# EAGLE board csa_cpu_v2.0k (EAGLE 4.15), part 1 of 2
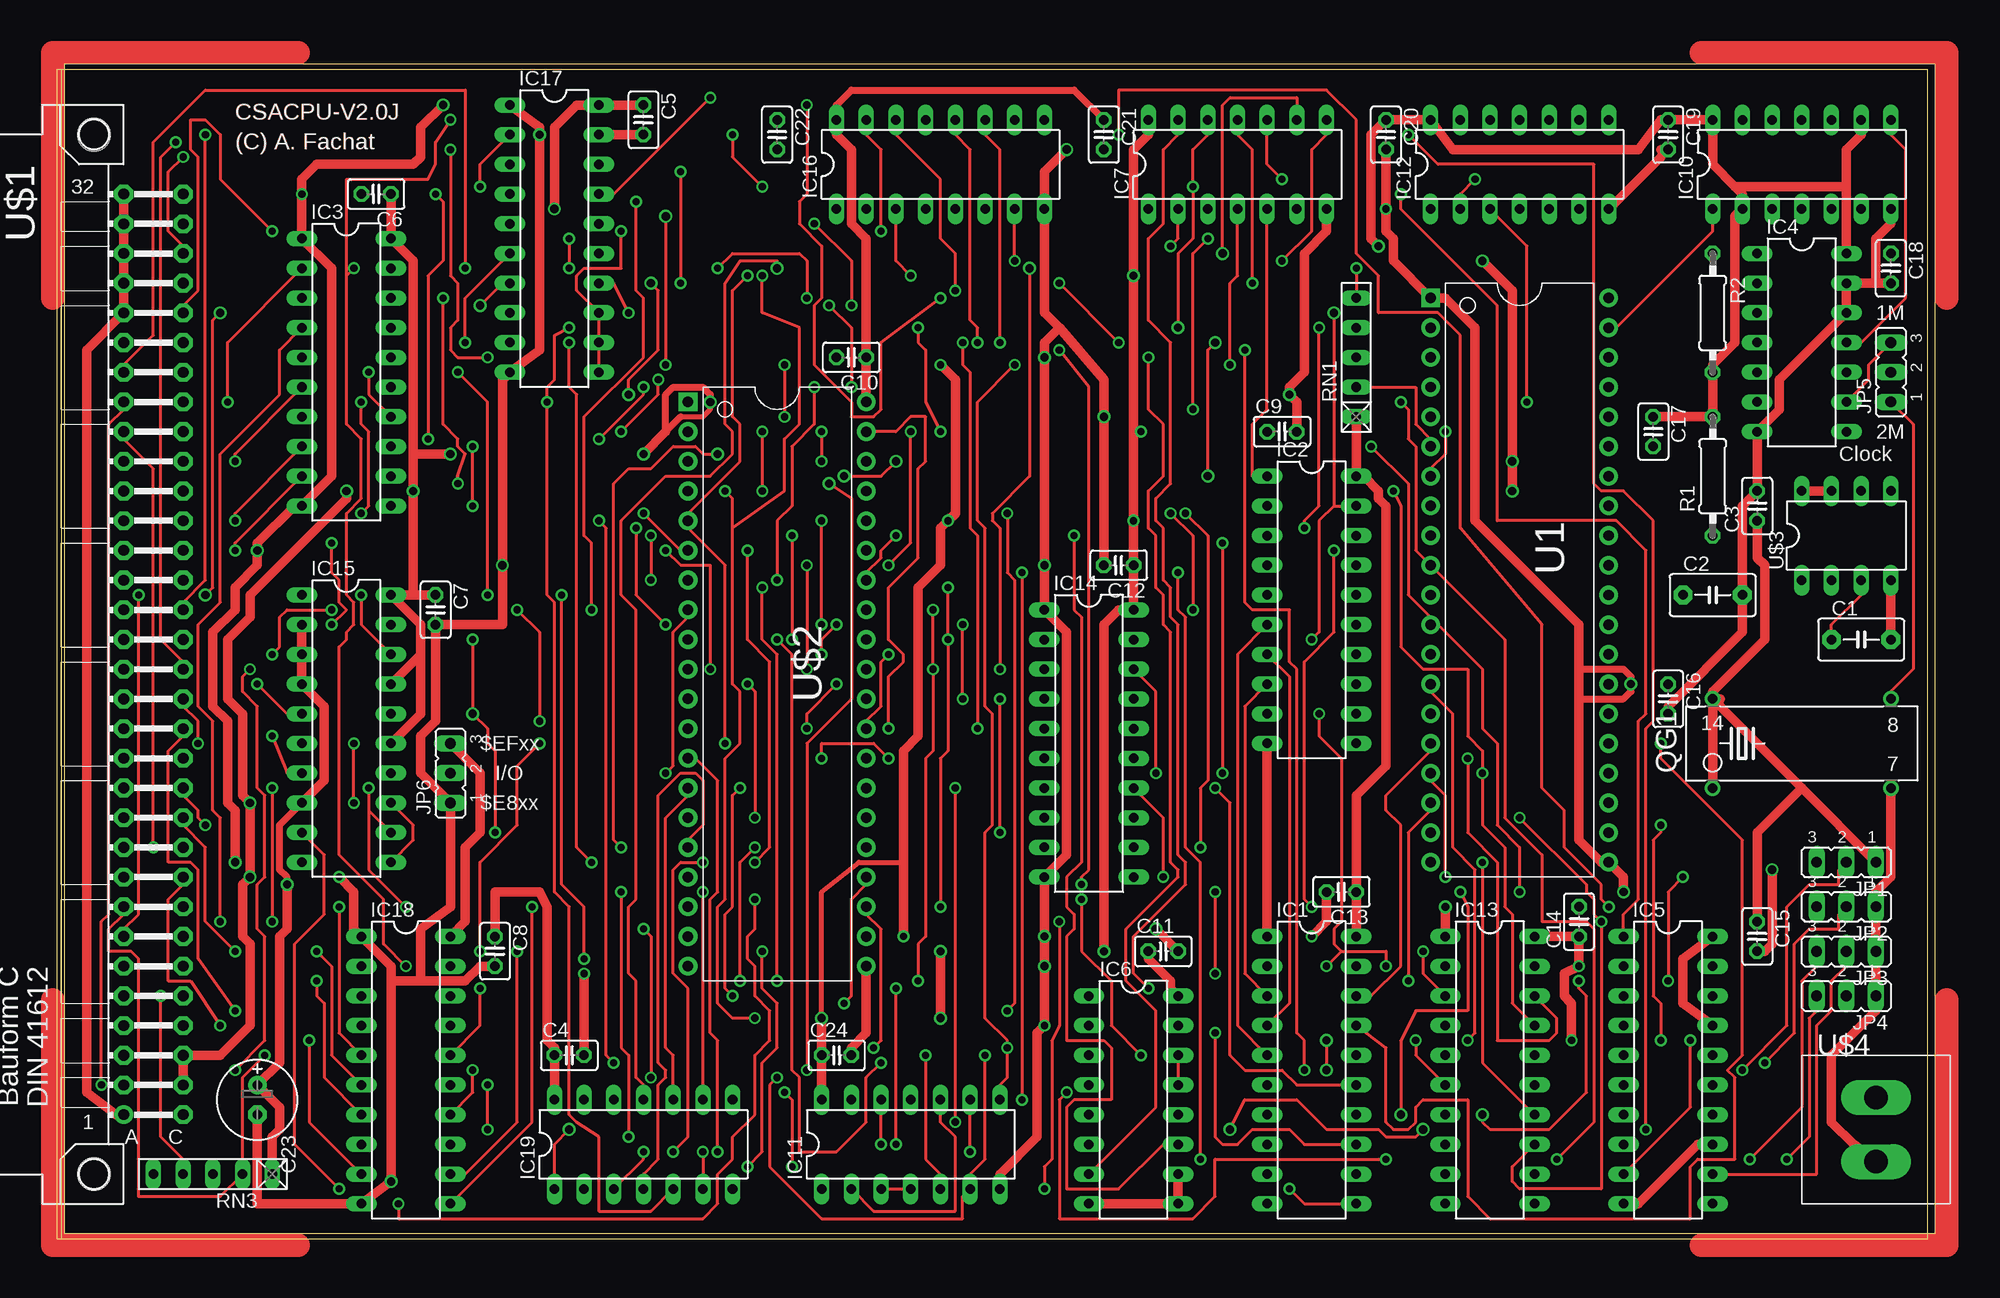
[diagram p2: board, top side]
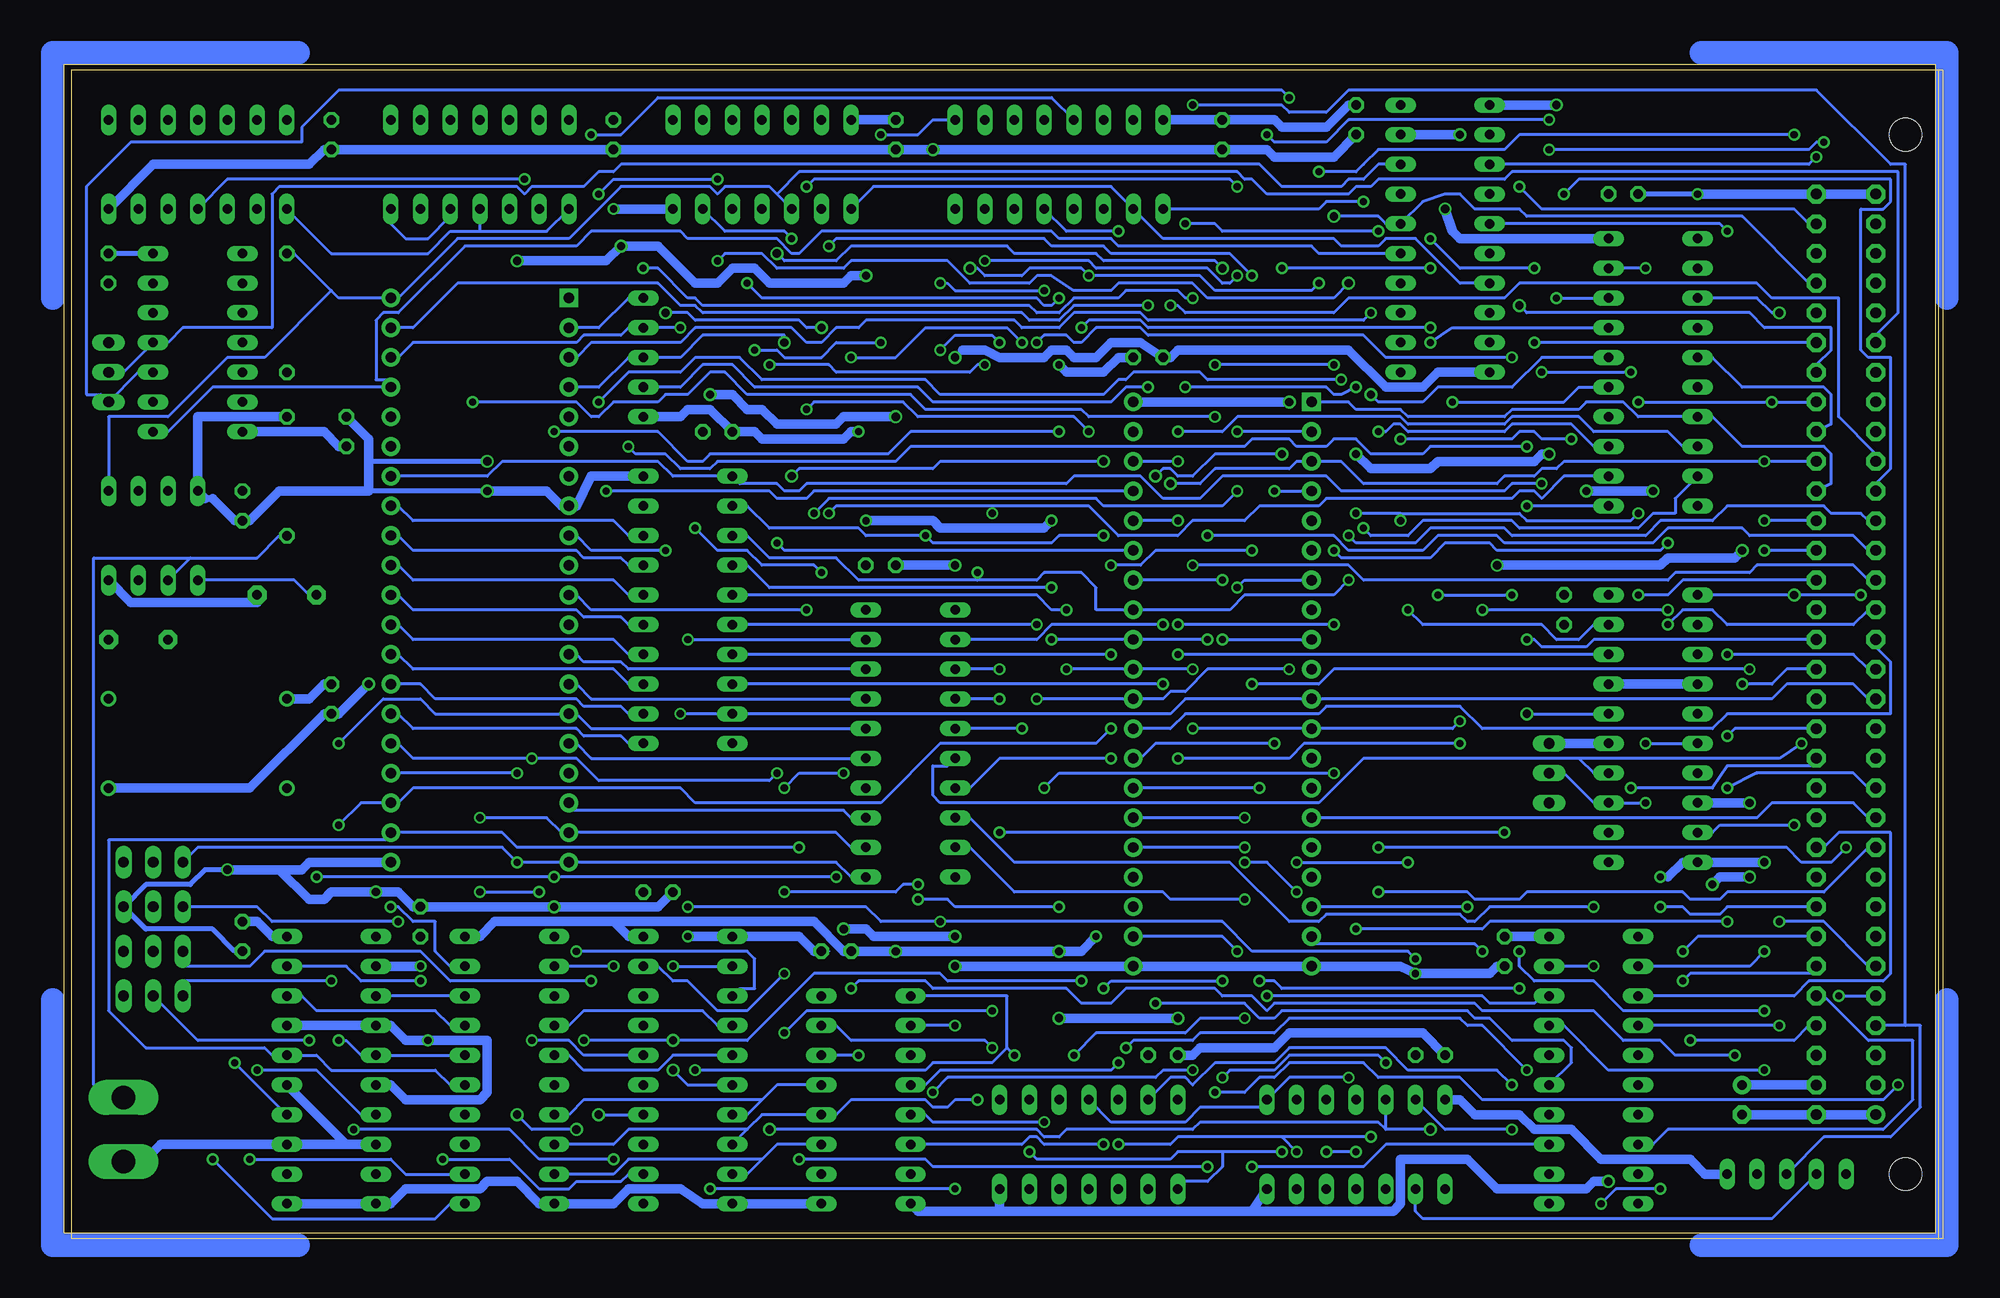
[diagram p3: board, bottom side, seen from below]

Size 160.63 x 100.48 mm. Coordinates in mm from the lower left corner, seen from the top.
Outline: 0,0.01 160,0.01 160,100.01 0,100.01 0,0.01
Outline: 0.63,0.48 160.63,0.48 160.63,100.48 0.63,100.48 0.63,0.48
Copper layers (1*16): Top 0.035mm / dielectric 1.5mm / Bottom 0.035mm
Design rules "default": minimum track width 10mil, minimum drill 24mil, track to track 6mil, track to pad 6mil, pad to pad 6mil, via to via 6mil, smd to smd 6mil, copper to edge 40mil, drill to drill 8mil, minimum pad ring 10mil, minimum via ring 8mil, stop-mask expansion 4mil, vias tented up to drill 0mil, thermal gap 10mil

## Footprints (pad centres in the part's own frame; a part is rotated, then mirrored left to right if it is on the bottom)
C5B3.5 = drill 0.813 pad 1.6 octagon: 1 -2.54,0; 2 2.54,0
C025-025X050 = drill 0.813 octagon: 1 -1.27,0; 2 1.27,0
E2,5-7 = drill 0.813 pad 1.6 round: + -1.27,0 | drill 0.813 pad 1.6 octagon: - 1.27,0
DIL20 = drill 0.813 long: 1 -11.43,-3.81; 2 -8.89,-3.81; 3 -6.35,-3.81; 4 -3.81,-3.81; 5 -1.27,-3.81; 6 1.27,-3.81; 7 3.81,-3.81; 8 6.35,-3.81; 9 8.89,-3.81; 10 11.43,-3.81; 11 11.43,3.81; 12 8.89,3.81; 13 6.35,3.81; 14 3.81,3.81; 15 1.27,3.81; 16 -1.27,3.81; 17 -3.81,3.81; 18 -6.35,3.81; 19 -8.89,3.81; 20 -11.43,3.81
DIL14 = drill 0.813 long: 1 -7.62,-3.81; 2 -5.08,-3.81; 3 -2.54,-3.81; 4 0,-3.81; 5 2.54,-3.81; 6 5.08,-3.81; 7 7.62,-3.81; 8 7.62,3.81; 9 5.08,3.81; 10 2.54,3.81; 11 0,3.81; 12 -2.54,3.81; 13 -5.08,3.81; 14 -7.62,3.81
DIL16 = drill 0.813 long: 1 -8.89,-3.81; 2 -6.35,-3.81; 3 -3.81,-3.81; 4 -1.27,-3.81; 5 1.27,-3.81; 6 3.81,-3.81; 7 6.35,-3.81; 8 8.89,-3.81; 9 8.89,3.81; 10 6.35,3.81; 11 3.81,3.81; 12 1.27,3.81; 13 -1.27,3.81; 14 -3.81,3.81; 15 -6.35,3.81; 16 -8.89,3.81
JP2 = drill 0.914 long: 1 -2.54,0; 2 0,0; 3 2.54,0
SG51 = drill 0.813 round: 1 -7.62,-3.81; 7 7.62,-3.81; 8 7.62,3.81; 14 -7.62,3.81
0207/10 = drill 0.813 octagon: 1 -5.08,0; 2 5.08,0
RN-5 = drill 0.813 long: 1 -5.08,0; 2 -2.54,0; 3 0,0; 4 2.54,0; 5 5.08,0
DIP-40 = drill 0.889 pad 1.6 square: 1 -22.86,-7.62 | drill 0.889 pad 1.6 round: 2 -20.32,-7.62; 3 -17.78,-7.62; 4 -15.24,-7.62; 5 -12.7,-7.62; 6 -10.16,-7.62; 7 -7.62,-7.62; 8 -5.08,-7.62; 9 -2.54,-7.62; 10 0,-7.62; 11 2.54,-7.62; 12 5.08,-7.62; 13 7.62,-7.62; 14 10.16,-7.62; 15 12.7,-7.62; 16 15.24,-7.62; 17 17.78,-7.62; 18 20.32,-7.62; 19 22.86,-7.62; 20 25.4,-7.62; 21 25.4,7.62; 22 22.86,7.62; 23 20.32,7.62; 24 17.78,7.62; 25 15.24,7.62; 26 12.7,7.62; 27 10.16,7.62; 28 7.62,7.62; 29 5.08,7.62; 30 2.54,7.62; 31 0,7.62; 32 -2.54,7.62; 33 -5.08,7.62; 34 -7.62,7.62; 35 -10.16,7.62; 36 -12.7,7.62; 37 -15.24,7.62; 38 -17.78,7.62; 39 -20.32,7.62; 40 -22.86,7.62
CSABUS = drill 0.914 pad 1.6 round: A1 7.62,36.83 | drill 0.914 pad 1.6 octagon: A2 7.62,34.29; A3 7.62,31.75; A4 7.62,29.21; A5 7.62,26.67; A6 7.62,24.13; A7 7.62,21.59; A8 7.62,19.05; A9 7.62,16.51; A10 7.62,13.97; A11 7.62,11.43; A12 7.62,8.89; A13 7.62,6.35; A14 7.62,3.81; A15 7.62,1.27; A16 7.62,-1.27; A17 7.62,-3.81; A18 7.62,-6.35; A19 7.62,-8.89; A20 7.62,-11.43; A21 7.62,-13.97; A22 7.62,-16.51; A23 7.62,-19.05; A24 7.62,-21.59; A25 7.62,-24.13; A26 7.62,-26.67; A27 7.62,-29.21; A28 7.62,-31.75; A29 7.62,-34.29; A30 7.62,-36.83; A31 7.62,-39.37; A32 7.62,-41.91; C1 2.54,36.83; C2 2.54,34.29; C3 2.54,31.75; C4 2.54,29.21; C5 2.54,26.67; C6 2.54,24.13; C7 2.54,21.59; C8 2.54,19.05; C9 2.54,16.51; C10 2.54,13.97; C11 2.54,11.43; C12 2.54,8.89; C13 2.54,6.35; C14 2.54,3.81; C15 2.54,1.27; C16 2.54,-1.27; C17 2.54,-3.81; C18 2.54,-6.35; C19 2.54,-8.89; C20 2.54,-11.43; C21 2.54,-13.97; C22 2.54,-16.51; C23 2.54,-19.05; C24 2.54,-21.59; C25 2.54,-24.13; C26 2.54,-26.67; C27 2.54,-29.21; C28 2.54,-31.75; C29 2.54,-34.29; C30 2.54,-36.83; C31 2.54,-39.37; C32 2.54,-41.91 | hole 2.794: 10.16,41.91; 10.16,-46.99
DIP40 = drill 0.889 pad 1.6 square: 1 -24.13,-7.62 | drill 0.889 pad 1.6 round: 2 -21.59,-7.62; 3 -19.05,-7.62; 4 -16.51,-7.62; 5 -13.97,-7.62; 6 -11.43,-7.62; 7 -8.89,-7.62; 8 -6.35,-7.62; 9 -3.81,-7.62; 10 -1.27,-7.62; 11 1.27,-7.62; 12 3.81,-7.62; 13 6.35,-7.62; 14 8.89,-7.62; 15 11.43,-7.62; 16 13.97,-7.62; 17 16.51,-7.62; 18 19.05,-7.62; 19 21.59,-7.62; 20 24.13,-7.62; 21 24.13,7.62; 22 21.59,7.62; 23 19.05,7.62; 24 16.51,7.62; 25 13.97,7.62; 26 11.43,7.62; 27 8.89,7.62; 28 6.35,7.62; 29 3.81,7.62; 30 1.27,7.62; 31 -1.27,7.62; 32 -3.81,7.62; 33 -6.35,7.62; 34 -8.89,7.62; 35 -11.43,7.62; 36 -13.97,7.62; 37 -16.51,7.62; 38 -19.05,7.62; 39 -21.59,7.62; 40 -24.13,7.62
DIL08@1 = drill 0.813 long: 1 -11.43,-2.54; 2 -8.89,-2.54; 3 -6.35,-2.54; 4 -3.81,-2.54; 5 -3.81,5.08; 6 -6.35,5.08; 7 -8.89,5.08; 8 -11.43,5.08
TASTER = drill 2.007 long: 1 0,4.013; 3 0,-1.473

## Placement (x,y rotation side)
C1  100n  [C5B3.5]  154.3,51.28 0 top
C2  100n  [C5B3.5]  141.6,55.09 0 top
C3  100n  [C025-025X050]  145.41,62.71 90 top
C4  100n  [C025-025X050]  43.81,15.72 0 top
C5  100n  [C025-025X050]  50.16,95.73 270 top
C6  100n  [C025-025X050]  27.3,89.38 180 top
C7  100n  [C025-025X050]  32.38,53.82 270 top
C8  100n  [C025-025X050]  37.46,24.61 270 top
C9  100n  [C025-025X050]  104.77,69.06 0 top
C10  100n  [C025-025X050]  67.94,75.41 180 top
C11  100n  [C025-025X050]  94.61,24.61 0 top
C12  100n  [C025-025X050]  90.8,57.63 180 top
C13  100n  [C025-025X050]  109.85,29.69 180 top
C14  100n  [C025-025X050]  130.17,27.15 90 top
C15  100n  [C025-025X050]  145.41,25.88 270 top
C16  100n  [C025-025X050]  137.79,46.2 270 top
C17  100n  [C025-025X050]  136.52,69.06 270 top
C18  100n  [C025-025X050]  156.84,83.03 270 top
C19  100n  [C025-025X050]  137.79,94.46 270 top
C20  100n  [C025-025X050]  113.66,94.46 270 top
C21  100n  [C025-025X050]  89.53,94.46 270 top
C22  100n  [C025-025X050]  61.59,94.46 270 top
C23  47u  [E2,5-7]  17.14,11.91 270 top
C24  100n  [C025-025X050]  66.67,15.72 0 top
IC1  74LS245N  [DIL20]  107.31,14.45 270 top
IC2  74LS245N  [DIL20]  107.31,53.82 270 top
IC3  74LS245N  [DIL20]  24.76,74.14 270 top
IC4  74LS293N  [DIL14]  149.22,76.68 270 top
IC5  74LS688N  [DIL20]  137.79,14.45 270 top
IC6  74LS173N  [DIL16]  92.07,11.91 270 top
IC7  74LS14N  [DIL14]  100.96,91.92 0 top
IC10  74LS164N  [DIL14]  149.22,91.92 0 top
IC11  74LS02N  [DIL14]  73.02,8.1 0 top
IC12  74LS86N  [DIL14]  125.09,91.92 0 top
IC13  74LS245N  [DIL20]  122.55,14.45 270 top
IC14  74LS245N  [DIL20]  88.26,42.39 270 top
IC15  74LS688N  [DIL20]  24.76,43.66 270 top
IC16  74LS139N  [DIL16]  75.56,91.92 0 top
IC17  74LS245N  [DIL20]  42.54,85.57 270 top
IC18  74LS245N  [DIL20]  29.84,14.45 270 top
IC19  74ALS08N  [DIL14]  50.16,8.1 0 top
JP1  [JP2]  153.03,32.23 180 top
JP2  [JP2]  153.03,28.42 180 top
JP3  [JP2]  153.03,24.61 180 top
JP4  [JP2]  153.03,20.8 180 top
JP5  [JP2]  156.84,74.14 90 top
JP6  [JP2]  33.65,39.85 90 top
QG1  16MHz  [SG51]  149.22,42.39 0 top
R1  10k  [0207/10]  141.6,65.25 90 top
R2  4k7  [0207/10]  141.6,79.22 270 top
RN1  4k7  [RN-5]  111.12,75.41 90 top
RN3  4k7  [RN-5]  13.33,5.56 180 top
U1  [DIP-40]  125.09,57.63 270 top
U$1  CSABUS  [CSABUS]  13.33,47.47 180 top
U$2  LS610SMALLPADS  [DIP40]  61.59,47.47 270 top
U$3  TL7705  [DIL08@1]  160.65,58.9 0 top
U$4  TASTER  [TASTER]  155.57,8.1 0 top